# EAGLE design Attenuverting Mixer Slim Front Panel v1 (EAGLE 7.7.0)
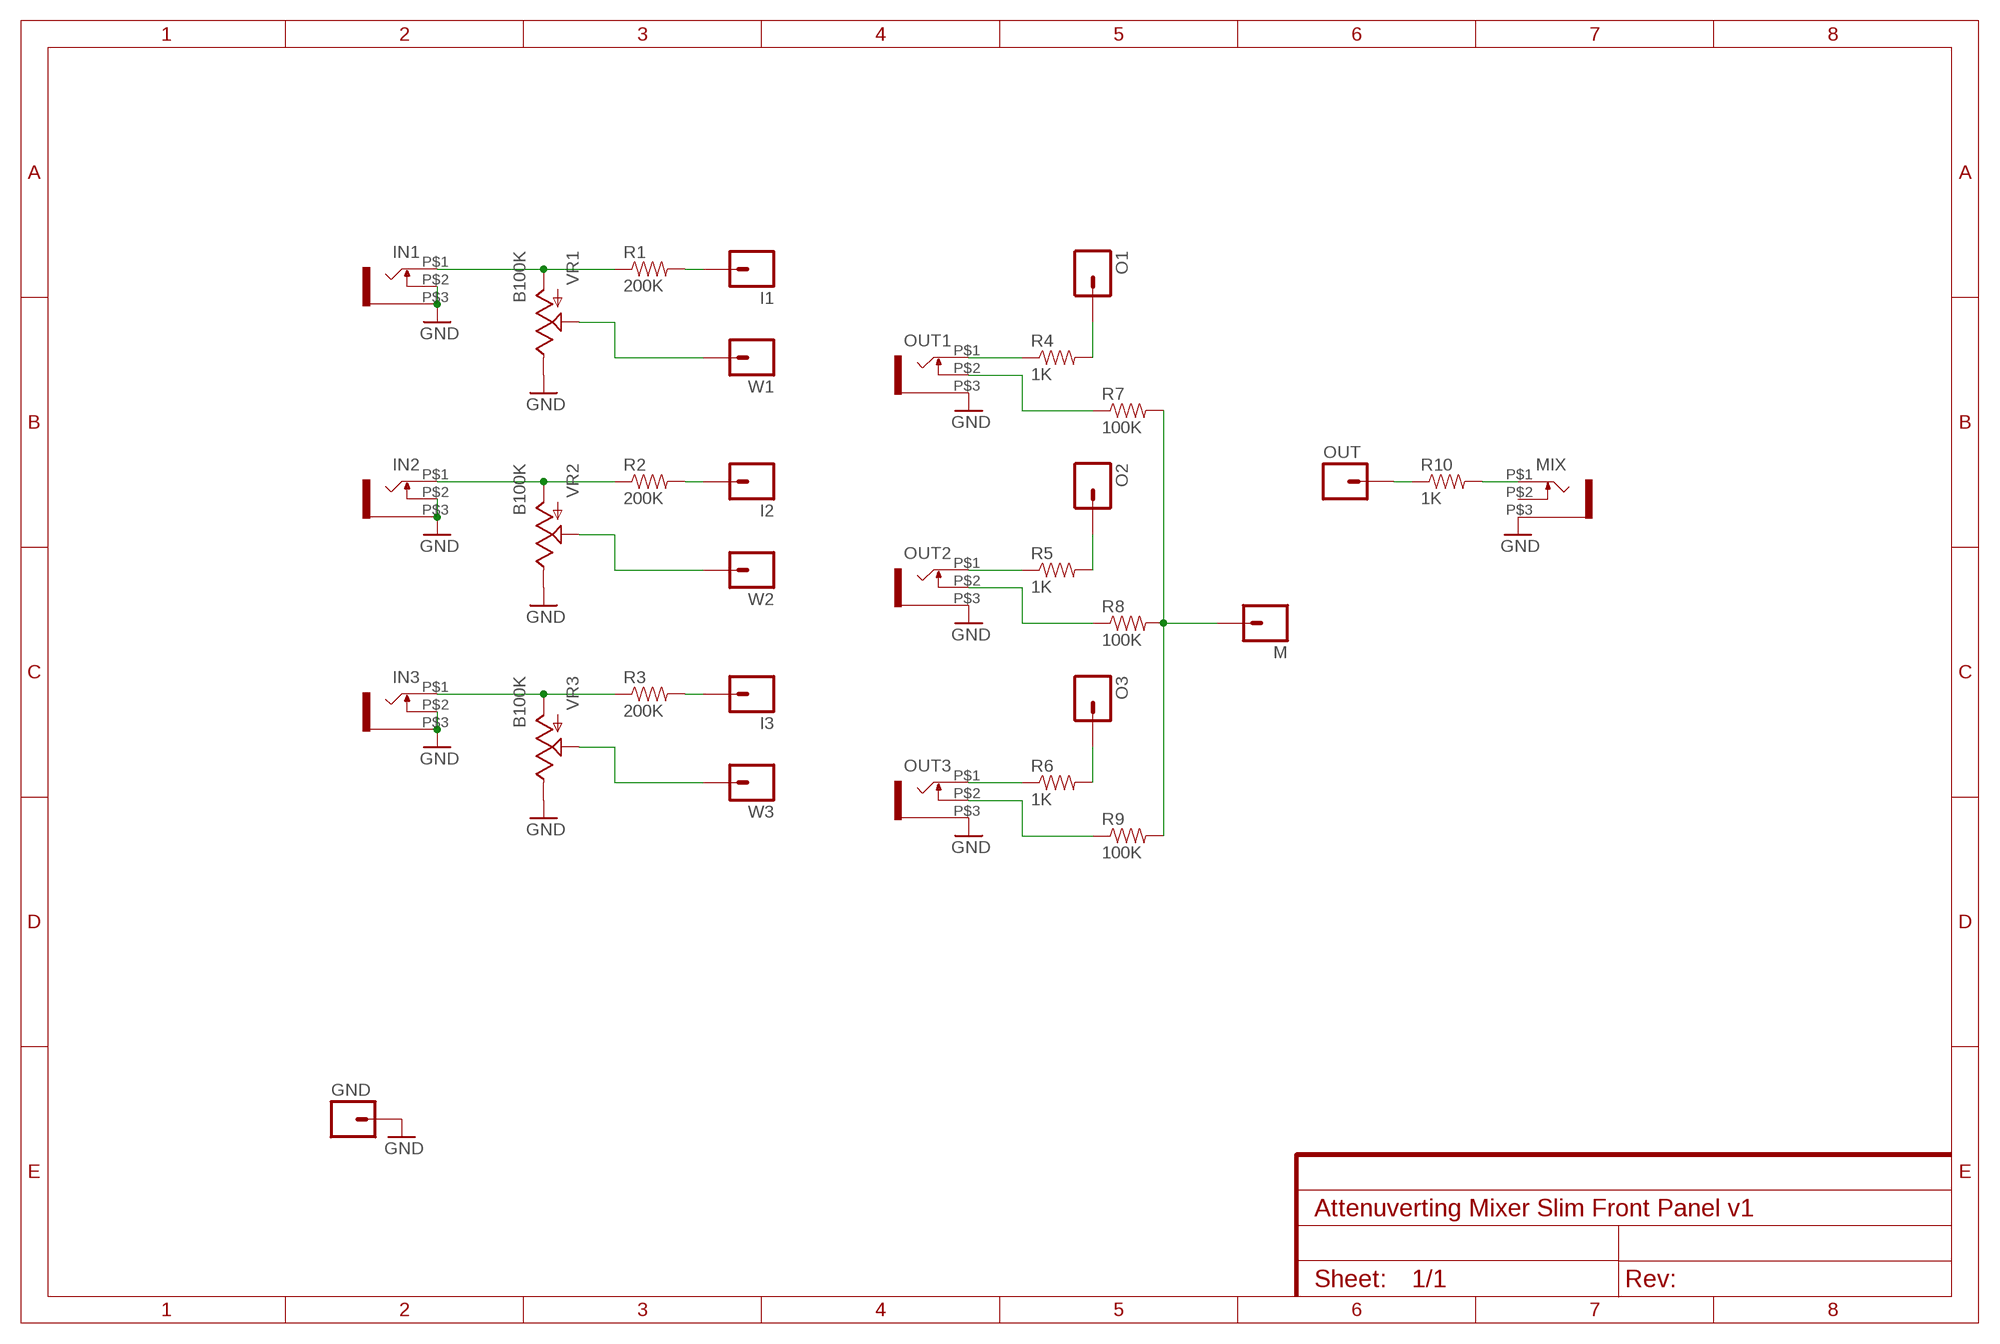
[diagram p0: schematic, sheet 1]

## Parts
GND  M01PTH  [1X01]
I1  M01PTH  [1X01]
I2  M01PTH  [1X01]
I3  M01PTH  [1X01]
IN1  WQP-PJ301M-12_JACK  [WQP-PJ301M-12_JACK]
IN2  WQP-PJ301M-12_JACK  [WQP-PJ301M-12_JACK]
IN3  WQP-PJ301M-12_JACK  [WQP-PJ301M-12_JACK]
M  M01PTH  [1X01]
MIX  WQP-PJ301M-12_JACK  [WQP-PJ301M-12_JACK]
O1  M01PTH  [1X01]
O2  M01PTH  [1X01]
O3  M01PTH  [1X01]
OUT  M01PTH  [1X01]
OUT1  WQP-PJ301M-12_JACK  [WQP-PJ301M-12_JACK]
OUT2  WQP-PJ301M-12_JACK  [WQP-PJ301M-12_JACK]
OUT3  WQP-PJ301M-12_JACK  [WQP-PJ301M-12_JACK]
R1  200K  RESISTOR0805-RES  [0805]
R2  200K  RESISTOR0805-RES  [0805]
R3  200K  RESISTOR0805-RES  [0805]
R4  1K  RESISTOR0805-RES  [0805]
R5  1K  RESISTOR0805-RES  [0805]
R6  1K  RESISTOR0805-RES  [0805]
R7  100K  RESISTOR0805-RES  [0805]
R8  100K  RESISTOR0805-RES  [0805]
R9  100K  RESISTOR0805-RES  [0805]
R10  1K  RESISTOR0805-RES  [0805]
VR1  B100K  POT  [ALPS_POT]
VR2  B100K  POT  [ALPS_POT]
VR3  B100K  POT  [ALPS_POT]
W1  M01PTH  [1X01]
W2  M01PTH  [1X01]
W3  M01PTH  [1X01]

## Nets
GND: GND.1 IN1.P$2 IN1.P$3 IN2.P$2 IN2.P$3 IN3.P$2 IN3.P$3 MIX.P$3 OUT1.P$3 OUT2.P$3 OUT3.P$3 VR1.P$1(E) VR2.P$1(E) VR3.P$1(E)
N$1: IN1.P$1 R1.1 VR1.P$3(A)
N$2: I1.1 R1.2
N$3: VR1.P$2(S) W1.1
N$4: IN2.P$1 R2.1 VR2.P$3(A)
N$5: I2.1 R2.2
N$6: VR2.P$2(S) W2.1
N$7: IN3.P$1 R3.1 VR3.P$3(A)
N$8: I3.1 R3.2
N$9: VR3.P$2(S) W3.1
N$10: OUT1.P$1 R4.1
N$11: OUT2.P$1 R5.1
N$12: O2.1 R5.2
N$13: O1.1 R4.2
N$14: OUT3.P$1 R6.1
N$15: O3.1 R6.2
N$16: OUT3.P$2 R9.1
N$17: OUT2.P$2 R8.1
N$18: OUT1.P$2 R7.1
N$19: M.1 R7.2 R8.2 R9.2
N$20: OUT.1 R10.1
N$21: MIX.P$1 R10.2
Unconnected: MIX.P$2

## Library data of the parts
GND I1-I3 M O1-O3 OUT W1-W3 = SparkFun-Connectors:M01: Header 1 Standard 1-pin 0.1" header. Use with straight break away headers (SKU : PRT-00116), right angle break away headers (PRT-00553), swiss pins (PRT-00743), machine pins (PRT-00117), and female headers (PRT-00115).
IN1-IN3 MIX OUT1-OUT3 = thonkiconn:WQP-PJ301M-12_JACK
R1-R10 = SparkFun-Passives:RESISTOR: Resistor Basic schematic elements and footprints for 0603, 1206, and PTH resistors.
VR1-VR3 = SparkFun-Electromechanical:POT; PROD_ID: RES-09177

## Board
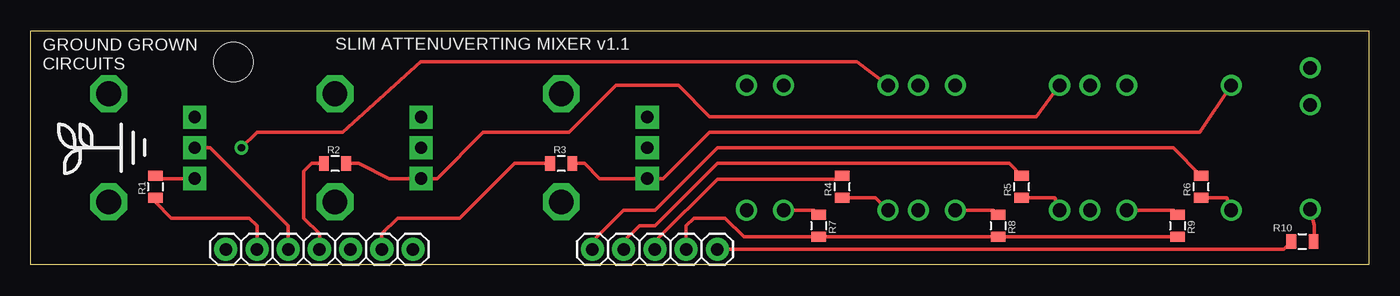
[diagram p1: board, top side]
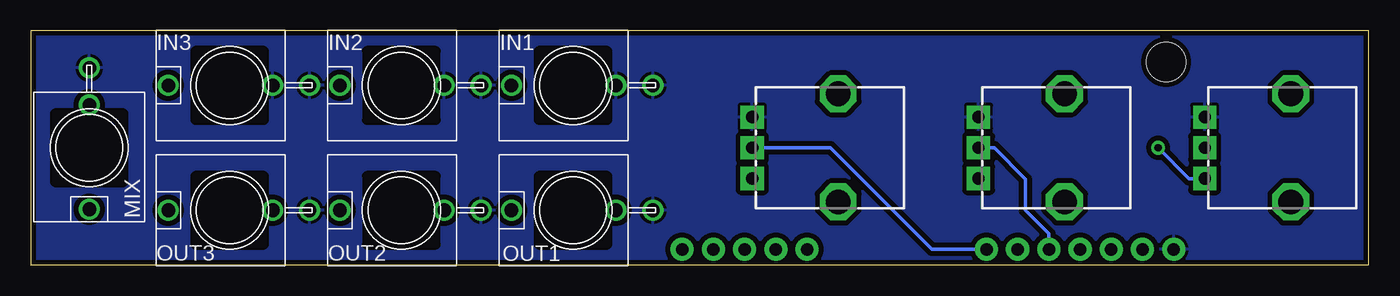
[diagram p2: board, bottom side, seen from below]

Size 108.9 x 19.05 mm. Coordinates in mm from the lower left corner, seen from the top.
Outline: 0,0 0,19.05 108.9,19.05 108.9,0 0,0
Copper layers (1*16): Top 0.035mm / dielectric 1.5mm / Bottom 0.035mm
Design rules "SparkFun": minimum track width 8mil, minimum drill 20mil, track to track 8mil, track to pad 8mil, pad to pad 8mil, via to via 8mil, smd to smd 8mil, copper to edge 8mil, drill to drill 8mil, minimum pad ring 12mil, minimum via ring 10mil, stop-mask expansion 4mil, vias tented up to drill 20mil, thermal gap 10mil
Holes 3.2 mm at 16.51,16.51

### Footprints (pad centres in the part's own frame; a part is rotated, then mirrored left to right if it is on the bottom)
1X01 = drill 1.016 pad 1.88: 1 0,0
WQP-PJ301M-12_JACK = drill 1.1: P$1 0,5; P$2 0,-3.5; P$3 0,-6.5
0805 = smd 0.8 x 1.2: 1 -0.9,0; 2 0.9,0
ALPS_POT = drill 1 pad 1.88 square: P$1 7,-2.5; P$2 7,0; P$3 7,2.5 | drill 2 octagon: P$4 0,-4.4; P$5 0,4.4

### Placement (x,y rotation side)
GND  15.88,1.27 0 top
I1  18.41,1.27 0 top
I2  23.5,1.27 0 top
I3  28.57,1.27 0 top
IN1  64.77,14.61 90 bottom
IN2  78.74,14.61 90 bottom
IN3  92.71,14.61 90 bottom
M  53.34,1.27 0 top
MIX  104.14,9.53 180 bottom
O1  50.8,1.27 0 top
O2  48.26,1.27 0 top
O3  45.72,1.27 0 top
OUT  55.88,1.27 0 top
OUT1  64.77,4.45 90 bottom
OUT2  78.74,4.45 90 bottom
OUT3  92.71,4.45 90 bottom
R1  10.16,6.35 270 top
R2  24.77,8.26 180 top
R3  43.18,8.26 180 top
R4  66.04,6.35 90 top
R5  80.64,6.35 90 top
R6  95.25,6.35 90 top
R7  64.14,3.17 270 top
R8  78.74,3.17 270 top
R9  93.34,3.17 270 top
R10  103.5,1.91 0 top
U$1  [LOGO_SMALL]  7.3,9.53 90 top
VR1  6.35,9.53 180 bottom
VR2  24.77,9.53 180 bottom
VR3  43.18,9.53 180 bottom
W1  20.95,1.27 0 top
W2  26.04,1.27 0 top
W3  31.11,1.27 0 top

### Tracks (layer width: path | path; a pad name or v marks a point on that pad's centre or on a via)
GND
  pour Bottom (isolate 0.406): 0,0 0,19.05 108.9,19.05 108.9,0
N$1  (via drill 0.6)
  Top 0.305: VR1.P$3 10.38,7.03 R1.1 | v17.14,9.53 18.41,10.79 25.4,10.79 31.75,16.51 67.23,16.51 IN1.P$1
  Bottom 0.305: VR1.P$3 14.64,7.03 v17.14,9.53
N$2
  Top 0.305: R1.2 10.16,5.08 11.43,3.81 17.78,3.81 18.41,3.17 I1.1
N$3
  Top 0.305: VR1.P$2 14.61,9.53 20.95,3.17 W1.1
N$4
  Top 0.305: R2.1 26.67,8.26 29.17,7.03 VR2.P$3 33.06,7.03 36.83,10.79 43.81,10.79 47.62,14.61 52.7,14.61 55.24,12.06 81.83,12.06 IN2.P$1
N$5
  Top 0.305: R2.2 22.86,8.26 22.23,7.62 22.23,3.81 23.5,2.54 I2.1
N$6
  Bottom 0.305: VR2.P$2 30.48,9.53 27.94,6.99 27.94,4.45 26.04,2.54 W2.1
N$7
  Top 0.305: R3.1 45.09,8.26 46.31,7.03 VR3.P$3 51.48,7.03 55.24,10.79 95.17,10.79 IN3.P$1
N$8
  Top 0.305: R3.2 39.37,8.26 34.92,3.81 29.84,3.81 28.57,2.54 I3.1
N$9
  Bottom 0.305: VR3.P$2 43.81,9.53 35.56,1.27 W3.1
N$10
  Top 0.305: R4.1 68.77,5.45 OUT1.P$1
N$11
  Top 0.305: R5.1 83.37,5.45 OUT2.P$1
N$12
  Top 0.305: O2.1 48.26,1.91 49.53,3.17 50.8,3.17 55.88,8.26 79.64,8.26 R5.2
N$13
  Top 0.305: O1.1 50.8,1.91 55.88,6.99 65.78,6.99 R4.2
N$14
  Top 0.305: R6.1 97.34,5.45 OUT3.P$1
N$15
  Top 0.305: O3.1 45.72,1.91 48.26,4.45 50.8,4.45 55.88,9.53 92.97,9.53 R6.2
N$16
  Top 0.305: OUT3.P$2 92.97,4.45 R9.1
N$17
  Top 0.305: OUT2.P$2 78.37,4.45 R8.1
N$18
  Top 0.305: OUT1.P$2 63.77,4.45 R7.1
N$19
  Top 0.305: R9.2 R8.2 R7.2 58.05,2.27 56.52,3.81 53.98,3.81 53.34,3.17 M.1
N$20
  Top 0.305: OUT.1 101.97,1.27 R10.1
N$21
  Top 0.305: R10.2 104.46,2.54 104.46,3.17 MIX.P$1

### Text on the board
tPlace: SLIM ATTENUVERTING MIXER v1.1 | GROUND GROWN / CIRCUITS